# EAGLE board starduino (EAGLE 7.6.0)
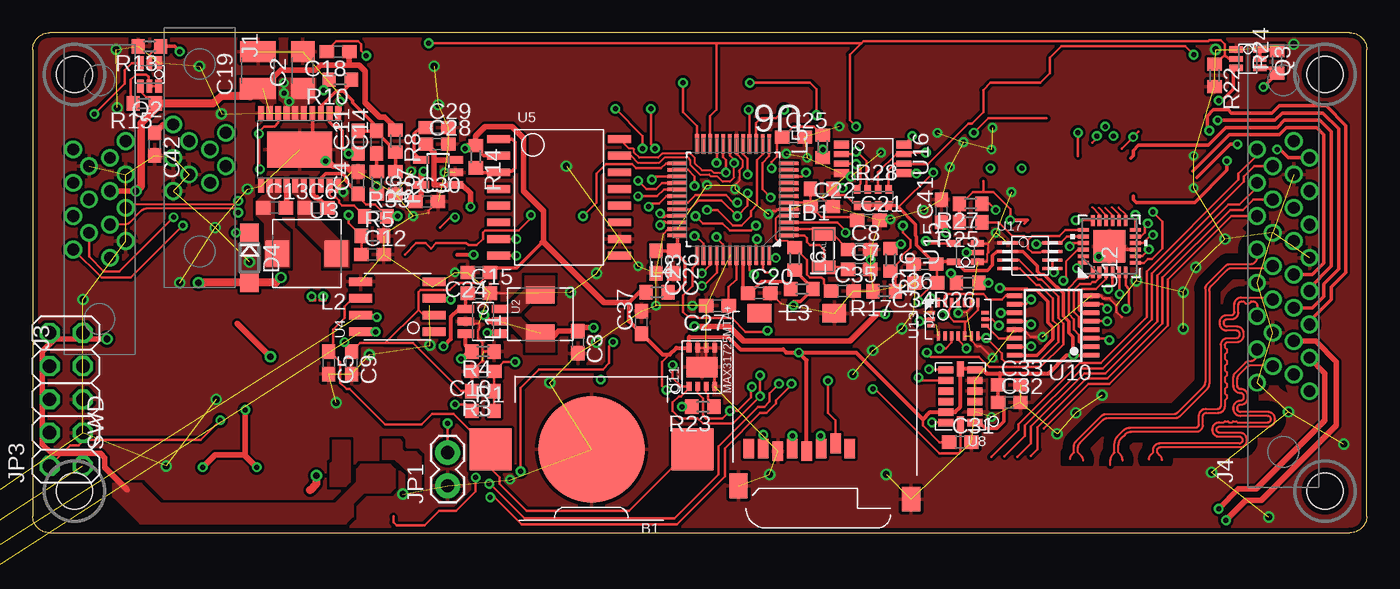
[diagram p2: board, top side]
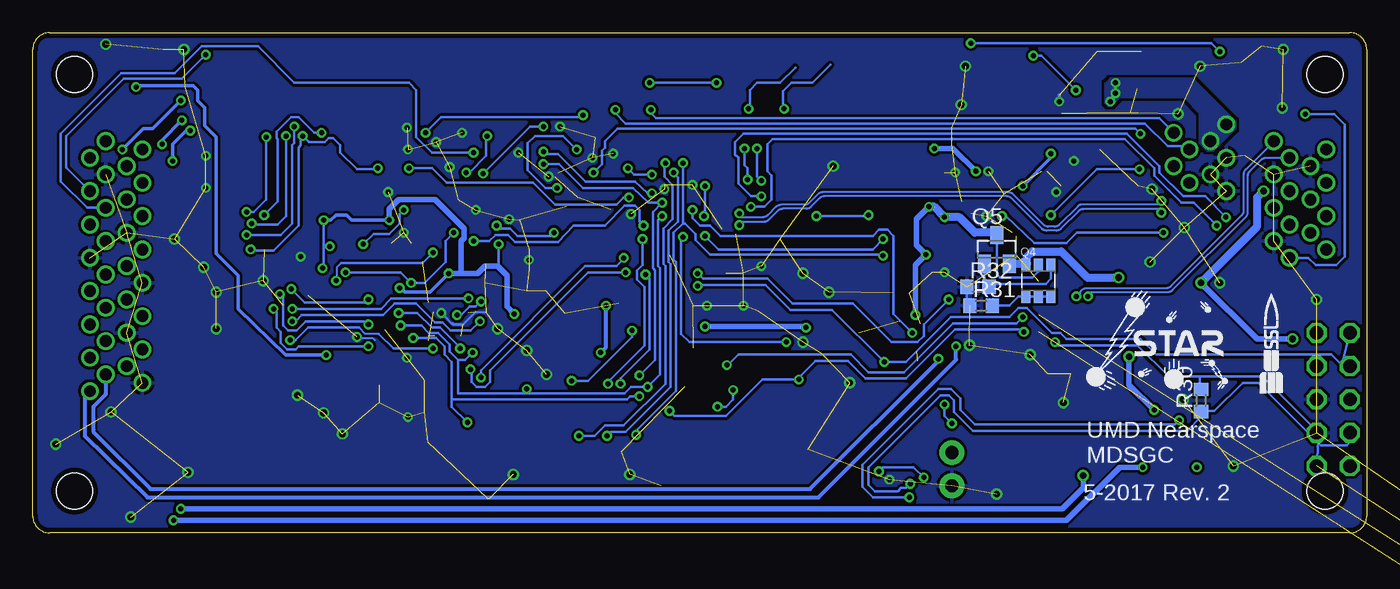
[diagram p3: board, bottom side, seen from below]

Size 101.6 x 38.1 mm. Coordinates in mm from the lower left corner, seen from the top.
Outline: 1.27,0 100.33,0 arc90 101.6,1.27 101.6,36.83 arc90 100.33,38.1 1.27,38.1 arc90 0,36.83 0,1.27 arc90 1.27,0
Copper layers (1*16): Top 0.0356mm / dielectric 1.5011mm / Bottom 0.0356mm
Design rules "LaenPCBOrder *": minimum track width 6mil, minimum drill 13mil, track to track 6mil, track to pad 6mil, pad to pad 6mil, via to via 6mil, smd to smd 6mil, copper to edge 15mil, drill to drill 6mil, minimum pad ring 7mil, minimum via ring 7mil, stop-mask expansion 4mil, vias tented up to drill 20mil, thermal gap 10mil
Net classes: 0 default: width 0.152 mm, drill 0.381 mm, clearance 0.152 mm; 1 PWR_SIG: width 0.203 mm, drill 0.381 mm, clearance 0.152 mm; 2 CTRL_SIG: width 0.203 mm, drill 0.381 mm, clearance 0.152 mm; 3 DIFF_PAIR: width 0.152 mm, drill 0.33 mm, clearance 0.152 mm
Holes 2.75 mm at 3.17,34.92 3.17,3.17 98.42,3.17 98.42,34.92

## Footprints (pad centres in the part's own frame; a part is rotated, then mirrored left to right if it is on the bottom)
CR1025 = smd 3.2 x 3.2: 1 -7.695,0; 2 7.695,0 | smd 8.13 x 8.13: 3 0,0
C1206 = smd 1.6 x 1.8: 1 -1.4,0; 2 1.4,0
C0603 = smd 1.1 x 1: 1 -0.85,0; 2 0.85,0
C1210 = smd 1.6 x 2.7: 1 -1.4,0; 2 1.4,0
SOD123 = smd 1.4 x 1.4: A 1.9,0; C -1.9,0
0603 = smd 1 x 1.1: 1 -0.85,0; 2 0.85,0
ZKN-9-J30 = drill 0.9: 1 -2.54,-2; 2 -1.27,-0.8; 3 0,-2; 4 1.27,-0.8; 5 2.54,-2; 6 -1.905,2; 7 -0.635,0.8; 8 0.635,2; 9 1.905,0.8
MICROSD_PUSH_PUSH_AMPHENOL = smd 0.8 x 1.5: 1 -1.915,2.95; 2 -0.815,2.55; 3 0.285,2.95; 4 1.385,3.15; 5 2.485,2.95; 6 3.585,3.15; 7 4.685,2.95; 8 5.785,2.95 | smd 1.8 x 1.4: CD1 4.975,-7.35; G3 -0.725,-7.35 | smd 1.4 x 1.9: G1 -6.575,6.8; G2 6.575,5.8
ZKN-15-J30 = drill 0.9: 1 -4.445,-0.8; 2 -3.175,-2; 3 -1.905,-0.8; 4 -0.635,-2; 5 0.635,-0.8; 6 1.905,-2; 7 3.175,-0.8; 8 4.445,-2; 9 -3.81,2; 10 -2.54,0.8; 11 -1.27,2; 12 0,0.8; 13 1.27,2; 14 2.54,0.8; 15 3.81,2
ZKN-31-J30 = drill 0.9: 1 -9.525,-2; 2 -8.255,-0.8; 3 -6.985,-2; 4 -5.715,-0.8; 5 -4.445,-2; 6 -3.175,-0.8; 7 -1.905,-2; 8 -0.635,-0.8; 9 0.635,-2; 10 1.905,-0.8; 11 3.175,-2; 12 4.445,-0.8; 13 5.715,-2; 14 6.985,-0.8; 15 8.255,-2; 16 9.525,-0.8; 17 -8.89,2; 18 -7.62,0.8; 19 -6.35,2; 20 -5.08,0.8; 21 -3.81,2; 22 -2.54,0.8; 23 -1.27,2; 24 0,0.8; 25 1.27,2; 26 2.54,0.8; 27 3.81,2; 28 5.08,0.8; 29 6.35,2; 30 7.62,0.8; 31 8.89,2
1X02 = drill 1.016 pad 1.88: 1 0,0; 2 2.54,0
2X05 = drill 1.016 octagon: 1 -5.08,-1.27; 2 -5.08,1.27; 3 -2.54,-1.27; 4 -2.54,1.27; 5 0,-1.27; 6 0,1.27; 7 2.54,-1.27; 8 2.54,1.27; 9 5.08,-1.27; 10 5.08,1.27
VLF504012MT(TDK) = smd 1.3 x 2.2: P$1 -1.45,0; P$2 1.45,0
SRP5030 = smd 1.8 x 2: P$1 -2.25,0; P$2 2.25,0
SC70 = smd 0.5 x 1: 1 -0.7,-0.9; 3 0.7,-0.9; 4 0.7,0.9; 6 -0.7,0.9 | smd 0.4 x 1: 2 0,-0.9; 5 0,0.9
SOT-26 = smd 0.7 x 1: 1 -0.95,-1.2; 2 0,-1.2; 3 0.95,-1.2; 4 0.95,1.2; 5 0,1.2; 6 -0.95,1.2
SOT23 = smd 1 x 1.4: 1 -0.95,-1.1; 2 0.95,-1.1; 3 0,1.1
R0603 = smd 1 x 1.1: 1 -0.85,0; 2 0.85,0
0603-ARV = smd 0.5 x 0.65: 1 -1.2,-0.625; 2 -0.4,-0.625; 3 0.4,-0.625; 4 1.2,-0.625; 5 1.2,0.625; 6 0.4,0.625; 7 -0.4,0.625; 8 -1.2,0.625
HSC-SMT-8 = smd 1.143 x 2.032: 1 -3.81,-4.699; 2 -1.27,-4.699; 3 1.27,-4.699; 4 3.81,-4.699; 5 3.81,4.699; 6 1.27,4.699; 7 -1.27,4.699; 8 -3.81,4.699
SOT23-6 = smd 0.62 x 1.23: 1 -0.95,-1.31; 2 0,-1.31; 3 0.95,-1.31; 4 0.95,1.31; 5 0,1.31; 6 -0.95,1.31
TSSOP20 = smd 0.45 x 1.05: 1 -2.925,-2.775; 2 -2.275,-2.775; 3 -1.625,-2.775; 4 -0.975,-2.775; 5 -0.325,-2.775; 6 0.325,-2.775; 7 0.975,-2.775; 8 1.625,-2.775; 9 2.275,-2.775; 10 2.925,-2.775; 11 2.925,2.775; 12 2.275,2.775; 13 1.625,2.775; 14 0.975,2.775; 15 0.325,2.775; 16 -0.325,2.775; 17 -0.975,2.775; 18 -1.625,2.775; 19 -2.275,2.775; 20 -2.925,2.775 | smd 4.95 x 2.74: PAD 0,0
SOIC-8 = smd 0.65 x 1.75: 1 -1.905,-2.8; 2 -0.635,-2.8; 3 0.635,-2.8; 4 1.905,-2.8; 5 1.905,2.8; 6 0.635,2.8; 7 -0.635,2.8; 8 -1.905,2.8
SOP2-16 = smd 0.6 x 1.75: 1 -4.445,-4.6; 2 -3.175,-4.6; 3 -1.905,-4.6; 4 -0.635,-4.6; 5 0.635,-4.6; 6 1.905,-4.6; 7 3.175,-4.6; 8 4.445,-4.6; 9 4.445,4.6; 10 3.175,4.6; 11 1.905,4.6; 12 0.635,4.6; 13 -0.635,4.6; 14 -1.905,4.6; 15 -3.175,4.6; 16 -4.445,4.6
48-TQFP = smd 1.473 x 0.279: 1 -4.242,2.743; 2 -4.242,2.261; 3 -4.242,1.753; 4 -4.242,1.245; 5 -4.242,0.762; 6 -4.242,0.254; 7 -4.242,-0.254; 8 -4.242,-0.762; 9 -4.242,-1.245; 10 -4.242,-1.753; 11 -4.242,-2.261; 12 -4.242,-2.743; 25 4.242,-2.743; 26 4.242,-2.261; 27 4.242,-1.753; 28 4.242,-1.245; 29 4.242,-0.762; 30 4.242,-0.254; 31 4.242,0.254; 32 4.242,0.762; 33 4.242,1.245; 34 4.242,1.753; 35 4.242,2.261; 36 4.242,2.743 | smd 0.279 x 1.473: 13 -2.743,-4.242; 14 -2.261,-4.242; 15 -1.753,-4.242; 16 -1.245,-4.242; 17 -0.762,-4.242; 18 -0.254,-4.242; 19 0.254,-4.242; 20 0.762,-4.242; 21 1.245,-4.242; 22 1.753,-4.242; 23 2.261,-4.242; 24 2.743,-4.242; 37 2.743,4.242; 38 2.261,4.242; 39 1.753,4.242; 40 1.245,4.242; 41 0.762,4.242; 42 0.254,4.242; 43 -0.254,4.242; 44 -0.762,4.242; 45 -1.245,4.242; 46 -1.753,4.242; 47 -2.261,4.242; 48 -2.743,4.242
SOT23-5L = smd 0.55 x 1.2: 1 -0.95,-1.3; 2 0,-1.3; 3 0.95,-1.3; 4 0.95,1.3; 5 -0.95,1.3
LGA-14 = smd 1.145 x 0.55: 1 -1.097,2; 2 -1.097,1.2; 3 -1.097,0.4; 4 -1.097,-0.4; 5 -1.097,-1.2; 6 -1.097,-2; 8 1.097,-2; 9 1.097,-1.2; 10 1.097,-0.4; 11 1.097,0.4; 12 1.097,1.2; 13 1.097,2 | smd 0.55 x 1.145: 7 0,-2.098; 14 0,2.098
TSSOP16 = smd 0.35 x 1.2: 1 -2.275,-2.925; 2 -1.625,-2.925; 3 -0.975,-2.925; 4 -0.325,-2.925; 5 0.325,-2.925; 6 0.975,-2.925; 7 1.625,-2.925; 8 2.275,-2.925; 9 2.275,2.925; 10 1.625,2.925; 11 0.975,2.925; 12 0.325,2.925; 13 -0.325,2.925; 14 -0.975,2.925; 15 -1.625,2.925; 16 -2.275,2.925
DFN-8 = smd 0.7 x 0.35: 1 -1.475,0.975; 2 -1.475,0.325; 3 -1.475,-0.325; 4 -1.475,-0.975; 5 1.475,-0.975; 6 1.475,-0.325; 7 1.475,0.325; 8 1.475,0.975 | smd 1.58 x 2.35: 9 0,0
RTW24_2P45X2P45 = smd 0.85 x 0.28: 1 -1.975,1.25; 2 -1.975,0.75; 3 -1.975,0.25; 4 -1.975,-0.25; 5 -1.975,-0.75; 6 -1.975,-1.25; 13 1.975,-1.25; 14 1.975,-0.75; 15 1.975,-0.25; 16 1.975,0.25; 17 1.975,0.75; 18 1.975,1.25 | smd 0.28 x 0.85: 7 -1.25,-1.975; 8 -0.75,-1.975; 9 -0.25,-1.975; 10 0.25,-1.975; 11 0.75,-1.975; 12 1.25,-1.975; 19 1.25,1.975; 20 0.75,1.975; 21 0.25,1.975; 22 -0.25,1.975; 23 -0.75,1.975; 24 -1.25,1.975 | smd 2.45 x 2.45: 25 0,0
LGA-20 = smd 0.675 x 0.25: 1 1.262,1.5; 2 1.262,1; 3 1.262,0.5; 4 1.262,0; 5 1.262,-0.5; 6 1.262,-1; 7 1.262,-1.5; 11 -1.262,-1.5; 12 -1.262,-1; 13 -1.262,-0.5; 14 -1.262,0; 15 -1.262,0.5; 16 -1.262,1; 17 -1.262,1.5 | smd 0.25 x 0.55: 8 0.5,-2.05; 9 0,-2.05; 10 -0.5,-2.05; 18 -0.5,2.05; 19 0,2.05; 20 0.5,2.05
SC-70-5 = smd 0.5 x 1: 1 -0.7,-0.9; 3 0.7,-0.9; 4 0.7,0.9; 5 -0.7,0.9 | smd 0.4 x 1: 2 0,-0.9
TSSOP8 = smd 0.6 x 1.15: P$1 -1.087,-2.375; P$4 1.087,-2.375; P$5 1.087,2.375; P$8 -1.087,2.375 | smd 0.45 x 1.15: P$2 -0.362,-2.375; P$3 0.362,-2.375; P$6 0.362,2.375; P$7 -0.362,2.375
SSOP8 = smd 0.25 x 1.55: 1 -0.975,-1.7; 2 -0.325,-1.7; 3 0.325,-1.7; 4 0.975,-1.7; 5 0.975,1.7; 6 0.325,1.7; 7 -0.325,1.7; 8 -0.975,1.7
2-SMD = smd 1 x 1.8: P1 -1.275,0; P2 1.275,0

## Placement (x,y rotation side)
B1  CR1025  [CR1025]  42.55,6.35 180 top
C2  22uF  [C1206]  20.56,35.24 90 top
C3  1uF  [C0603]  41.51,14.53 270 top
C4  1uF  [C0603]  24.77,26.67 90 top
C5  1nF  [C0603]  22.54,12.94 270 top
C6  100nF  [C0603]  21.59,24.77 0 top
C7  6.8pF  [C0603]  62.94,20.08 0 top
C8  6.8pF  [C0603]  62.94,21.59 0 top
C9  100nF  [C0603]  24.29,12.94 270 top
C10  100nF  [C0603]  34.29,12.3 180 top
C11  10pF  [C0603]  24.77,29.77 90 top
C12  47pF  [C0603]  25.88,21.19 0 top
C13  100nF  [C0603]  18.41,24.77 0 top
C14  680pF  [C0603]  26.19,29.77 90 top
C15  1uF  [C0603]  33.97,18.26 0 top
C18  47pF  [C0603]  23.26,36.67 180 top
C19  47uF  [C1210]  17.14,35.24 90 top
C20  10uF  [C0603]  55.32,18.26 0 top
C21  10uF  [C0603]  63.66,23.81 0 top
C22  100nF  [C0603]  60.09,24.84 0 top
C23  100nF  [C0603]  47.47,20.64 270 top
C24  100nF  [C0603]  33.97,19.84 180 top
C25  100nF  [C0603]  57.94,30.16 0 top
C26  100nF  [C0603]  48.82,20.64 270 top
C27  1uF  [C0603]  52.15,17.3 180 top
C28  1uF  [C0603]  30.8,29.61 0 top
C29  100nF  [C0603]  30.8,30.88 0 top
C30  2.2uF  [C0603]  30,25.24 0 top
C31  10uF  [C0603]  70.64,6.91 0 top
C32  100nF  [C0603]  74.37,9.92 0 top
C33  100nF  [C0603]  74.37,11.27 0 top
C34  100nF  [C0603]  68.02,19.05 180 top
C35  100nF  [C0603]  61.67,18.41 0 top
C36  100nF  [C0603]  67.94,20.48 180 top
C37  100nF  [C0603]  46.35,16.03 90 top
C41  100pF  [C0603]  69.22,24.53 90 top
C42  1uF  [C0603]  9.29,29.61 270 top
D4  B0520LW-7-F  [SOD123]  16.51,20.95 270 top
FB1  BLM18KG221BH1D  [0603]  60.09,26.19 180 top
J1  J30J-9J30  [ZKN-9-J30]  12.7,28.57 270 top
J2  MICRO_SD  [MICROSD_PUSH_PUSH_AMPHENOL]  60.33,9.37 180 top
J3  J30J-15J30  [ZKN-15-J30]  5.08,25.4 90 top
J4  J30J-31J30  [ZKN-31-J30]  95.25,20.32 90 top
JP1  [1X02]  31.59,3.57 90 top
JP3  [2X05]  2.54,10.16 90 top
L1  22uH  [VLF504012MT(TDK)]  38.66,16.67 90 top
L2  4.7uH  [SRP5030]  20.88,21.27 180 top
L3  10uH  [0603]  58.58,18.57 180 top
L4  10uH  [0603]  47.55,18.34 0 top
L5  10uH  [0603]  60.17,29.45 90 top
L6  10uH  [0603]  58.02,20.88 270 top
Q2  BSS8402DW  [SC70]  8.89,34.92 180 top
Q3  BSS8402DW  [SC70]  92.55,36.12 270 top
Q4  DMMT5401  [SOT-26]  25,19.21 0 bottom
Q5  DMG2305UX  [SOT23]  28.18,21.59 0 bottom
R1  330  [R0603]  34.29,9.29 0 top
R3  10k  [R0603]  34.29,10.79 180 top
R4  6.2  [R0603]  34.29,13.81 180 top
R5  33k  [R0603]  25.88,22.62 0 top
R6  33k  [R0603]  26.19,26.67 270 top
R8  845k  [R0603]  27.62,29.84 270 top
R9  158k  [R0603]  27.62,26.67 270 top
R10  10k  [R0603]  23.42,34.53 180 top
R13  100k  [R0603]  8.89,37.07 180 top
R14  4.7k  [R0603]  33.73,28.65 270 top
R15  191k  [R0603]  8.49,32.7 180 top
R16  3.6k  [R0603]  65.33,20.8 270 top
R17  6.8k  [R0603]  64.85,18.41 180 top
R22  100k  [R0603]  90.01,34.85 270 top
R23  4.7k  [R0603]  51.04,9.6 180 top
R24  191k  [R0603]  94.77,35.88 90 top
R25  4.7k  [R0603]  71.44,23.65 180 top
R26  220k  [R0603]  71.2,19.05 180 top
R27  4.7k  [R0603]  71.44,25.08 180 top
R28  4.7k  [0603-ARV]  63.98,25.56 180 top
R30  10k  [R0603]  12.62,10.08 90 bottom
R31  10k  [R0603]  29.37,17.3 0 bottom
R32  47k  [R0603]  29.61,18.73 0 bottom
R33  1M  [R0603]  26.11,24.13 0 top
U1  SSCMNNN015PA2A3  [HSC-SMT-8]  -17.78,-5.08 0 top  (outside the outline)
U2  LT3465/A  [SOT23-6]  34.29,16.11 270 top
U3  LTC3112FE  [TSSOP20]  20.32,29.21 180 top
U4  DS3231MZ+  [SOIC-8]  27.78,17.22 90 top
U5  MT25QL01GBBB8ESF-0AAT  [SOP2-16]  40.08,25.56 270 top
U6  ATSAMD21G18  [48-TQFP]  53.34,25.4 180 top
U7  MIC5319  [SOT23-5L]  30.88,27.46 90 top
U8  ADXL375BCCZ  [LGA-14]  70.64,10.4 180 top
U10  MC14504BDTG  [TSSOP16]  77.71,15.8 90 top
U11  MAX31725MTA+  [DFN-8]  50.96,12.62 90 top
U12  TCA9535_RTW_24  [RTW24_2P45X2P45]  81.99,21.83 90 top
U13  BMX055  [LGA-20]  70.48,16.27 90 top
U15  MC74VHC1GT125  [SC-70-5]  71.04,21.35 90 top
U16  PCA9515A  [TSSOP8]  63.98,28.5 270 top
U17  PCA9306DCT  [SSOP8]  75.96,21.11 270 top
U$1  STAR  [STAR_.3IN]  21.35,10.87 0 bottom
U$2  SSL.3IN_SILK  [SSL_SILK_.3IN]  8.49,10.64 0 bottom
XTAL1  ABS07AIG-32.768KHZ-1-T  [2-SMD]  60.25,21.51 270 top

## Tracks (layer width: path | path; a pad name or v marks a point on that pad's centre or on a via)
5V_S  (via drill 0.38)  (1 unrouted)
  Top 0.203: U7.1 32.02,26.51 | U7.3 32.02,28.42 | 72.39,25.96 71.6,25.96 70.72,25.08 R27.2 | 72.39,25.96 73.18,25.96 74.45,24.69 v74.45,23.81 | 72.39,26.82 72.39,25.96 | v66.12,21.99 65.78,21.65 R16.1 | 79.46,20.25 v79.53,20.16 79.6,20.16 U12.24 | 75.75,23.81 75.51,23.57 | U12.18 80.73,23.81 v79.45,23.81 | v78.98,21.83 79.23,22.08 U12.21 | R26.2 69.93,19.47 | 31.02,23.24 31.83,24.05 v32.15,24.05 | C3.1 41.77,15.64
  Top 0.254: U12.23 U12.24 | 70.59,23.55 R25.2 R27.2 | 79.46,23.8 v79.45,23.81 | v74.45,23.81 75.75,23.81 | v69.93,19.76 69.93,19.47 | v73.66,18.65 73.9,18.65 73.98,18.57 75.72,18.57 75.8,18.49 76.44,18.49 77.31,17.62 77.31,16.03 77.71,15.64 77.71,14.76 76.47,13.52 U10.16
  Top 0.305: 32.33,21.19 v33.58,21.19
  Top 0.406: 30.56,28.42 30.56,26.51 32.02,26.51 | 32.02,28.42 30.56,28.42 | C3.1 40.06,15.38 39.61,14.92 39.16,14.92 L1.P$1 | v34.37,16.59 34.85,16.11 U2.5 | v64.93,16.67 64.29,16.67 62.23,14.61 54.13,14.61 53.02,15.72 v50.4,15.72 | v42.7,15.64 41.77,15.64 | v33.34,24.84 33.34,25.88 32.7,26.51 32.02,26.51 U7.1 | C28.1 30.56,29 30.56,28.42
  Bottom 0.203: 66.2,20.32 66.12,20.4 v66.12,21.99 | v79.53,20.16 79.45,20.24 79.45,21.75 | 79.45,21.75 v79.45,23.81 | v78.98,21.83 79.38,21.83 79.45,21.75 | 28.43,22.94 Q5.3 28.18,19.68 27.94,19.45 25.48,19.45 25,19.92 Q4.5
  Bottom 0.254: v74.45,23.81 77.31,23.81 77.71,24.21 78.5,24.21 78.9,23.81 v79.45,23.81 | v73.66,18.65 73.58,18.65 73.26,18.34 71.36,18.34 v69.93,19.76
  Bottom 0.406: v34.37,16.59 34.37,20.4 v33.58,21.19 34.29,21.91 34.29,23.89 v33.34,24.84 | v74.45,23.81 74.45,24.69 73.74,25.4 70.96,25.4 68.74,23.18 68.74,22.46 68.98,22.23 68.98,19.92 69.14,19.76 | v64.93,16.67 65.48,17.22 65.48,19.61 66.2,20.32 67.15,20.32 67.71,19.76 69.14,19.76 | v50.4,15.72 42.78,15.72 v42.7,15.64 | 69.14,19.76 v69.93,19.76
  Bottom 0.61: 28.43,22.94 28.51,22.86 29.84,22.86 31.04,24.05 v32.15,24.05 32.94,24.84 v33.34,24.84
  pour Top (rank 2, no thermals): 35,16.35 37.15,16.35 38.42,15.08 39.69,15.08 39.69,13.81 37.62,13.81 37.62,14.53 36.35,15.88 35,15.88
+3V3  (via drill 0.38)  (2 unrouted)
  Top 0.203: U10.1 79.98,13.52 | U13.3 69.98,17.2 69.77,16.99 69.77,16.59 v69.29,16.59 69.69,16.59 70.17,16.11 70.98,16.11 | 70.98,16.11 71.12,16.11 71.98,16.98 U13.7 | U13.13 70.98,16.11 | v67.47,17.62 67.47,17.86 68.66,19.05 C34.1 68.87,20.4 C36.1 68.97,20.65 | C31.1 69.06,6.91 67.79,8.18 67.79,8.65 | R23.2 v49.45,9.6 | C24.1 34.03,19.05 32.31,19.05 31.75,18.49 29.53,18.49 29.37,18.34 29.37,16.99 | 29.37,16.99 29.77,16.59 U4.2 | 29.37,16.99 26.83,14.45 | 26.83,14.45 24.92,14.45 24.29,13.81 C9.1 23.73,14.34 v23.73,14.53 | v57.94,17.3 57.94,17.62 | 26.83,14.45 28.97,14.45 32.62,10.79 R3.2 | v48.26,10.87 47.94,11.19 47.94,13.02 48.5,13.57 | U16.P$8 66.99,30.22 v66.99,30.24 | v68.58,27.46 65.92,24.8 | R28.5 62.7,24.93 61.91,25.72 61.41,25.72 FB1.1 61.59,26.19 v61.67,26.27 | v60.17,29.21 L5.1
  Top 0.254: C32.1 C33.1 73.66,11.49 73.66,12.14 | U8.6 71.64,12.5 | 73.82,9.71 C32.1 | v93.74,33.97 93.98,34.23 R24.1 94.39,35.42 Q3.4 | U10.1 79.24,13.52 v79.26,13.53 79.22,13.65 79.22,14.92 78.9,15.24 78.9,16.11 78.5,16.51 78.5,18.26 78.03,18.73 77.95,18.73 76.99,19.68 76.76,19.68 76.52,19.92 76.52,20.32 75.4,21.44 U17.2 73.43,21.44 73.1,21.11 73.1,20.4 72.71,20 70.96,20 70.31,20.65 U15.5 68.97,20.65 | U5.2 34.35,28.73 R14.1 | 57.94,17.62 58.48,17.62 L3.1 59.43,18.62 L6.2 58.02,19.98 | C24.1 35.22,20.16 36.83,20.16 38.77,22.11 | U8.1 72.09,8.4 72.55,7.94 73.42,7.94 73.98,8.49 73.98,9.47 C32.1 | R28.5 R28.6 R28.7 R28.8 65.79,24.93 65.92,24.8 67.23,23.5 67.23,22.7 67.31,22.54 67.31,21.91 68.74,20.48 C36.1 | 29.58,25.64 29.18,25.24 C30.1 | U11.8 49.94,14.05 | 46.2,18.34 L4.1
  Top 0.305: U8.6 72.4,12.4 72.65,12.14 73.66,12.14 77.39,12.14 78.78,13.53 v79.26,13.53 | 71.64,12.5 U8.7 70.64,9.6 70.24,9.2 U8.12 68.33,9.2 67.79,8.65 62.71,13.73 v58.34,13.73 | 49.98,14.92 U11.8 49.02,14.1 48.5,13.57 47.97,13.57 C37.1 45.4,16.14 45.4,17.54 46.2,18.34 | 49.98,14.92 | 49.98,14.92 52.94,14.92 53.9,13.97 57.15,13.97 57.39,13.73 v58.34,13.73 | J2.4 58.94,13.13 v58.34,13.73
  Top 0.406: 29.58,25.64 U7.5 29.58,27.35 v29.77,27.54 | v32.94,29.29 33.12,29.5 R14.1 33.73,30.24 34.45,30.96 36.51,30.96 37.39,30.08 37.39,26.04 38.89,24.53 38.89,22.15 | 38.77,22.11 38.89,22.15 | 38.89,22.15 43.5,17.54 45.4,17.54
  Bottom 0.203: v69.29,16.59 68.98,16.59 68.34,17.22 67.87,17.22 v67.47,17.62 | v49.45,9.6 48.82,9.6 48.26,10.16 v48.26,10.87 | v23.73,14.53 23.5,14.29 17.46,14.29 15.08,11.91 12.7,11.91 | 12.7,11.91 7.94,11.91 3.65,7.62 JP3.1 | v66.99,30.24 67.07,30.16 67.07,28.73 68.34,27.46 v68.58,27.46 | R30.2 12.7,11.01 12.7,11.91 | v61.67,26.27 62.55,26.27 63.9,27.62 63.9,29.69 63.34,30.24 61.2,30.24 v60.17,29.21
  Bottom 0.254: v93.74,33.97 93.66,34.05 89.38,34.05 89.06,33.73 89.06,32.94 88.5,32.38 88.5,31.04 87.63,30.16 87.63,21.27 85.96,19.61 85.96,17.07 82.35,13.53 v79.26,13.53
  Bottom 0.305: v58.34,13.73 57.94,14.13 v57.94,17.3
  Bottom 0.406: v29.77,27.54 31.51,29.29 v32.94,29.29
+5V  (via drill 0.51)  (1 unrouted)
  Top 0.203: R15.1 8.87,33.18 8.65,33.18 8.19,33.64 Q2.4
  Top 0.406: 24.11,35.64 21.91,35.64 21.51,35.24 18.89,35.24 17.49,33.84 C19.1 16.56,33.26 | 24.11,35.64 C18.1 | 24.11,35.64 24.84,35.64 25.32,35.16 25.32,32.78 26.43,31.67 26.81,31.67 27.62,30.85 R8.1 | v7.86,26.04 J3.5 | v5.64,14.76 1.67,14.76 0.71,13.81 0.71,6.75 1.43,6.03 5.16,6.03 5.48,5.71 5.48,5 7.19,3.29 | 13.02,19.05
  Top 0.559: 8.26,26.43 8.26,31.22 9.34,32.31
  Top 0.61: 16.56,33.26 14.37,33.26 13.73,32.7 R15.1 9.34,32.31 | 13.02,19.05 D4.A 18.5,19.05 v18.89,19.45 | v7.86,26.04 8.26,26.43 | 13.02,19.05 v12.62,19.05
  Bottom 0.203: Q4.6 26.03,20.49
  Bottom 0.406: Q4.6 25.88,20.49 | v12.62,19.05 8.33,14.76 v5.64,14.76
  Bottom 0.61: v12.62,19.05 8.33,23.34 8.33,25.56 v7.86,26.04 | 25.88,20.49 25.88,21.03 25.48,21.43 23.26,21.43 21.27,19.45 v18.89,19.45 | 26.03,20.49 Q5.2
  pour Top (rank 2, no thermals): 17.86,31.43 17.86,32.46 17.22,33.1 15.8,33.1 15.8,34.61 18.49,34.61 18.49,32.7 18.26,32.46 18.26,31.43
  pour Top (rank 2, no thermals): 27.54,4.84 27.23,5.16 25,5.16 24.69,4.84 24.69,3.89 23.02,2.22 22.7,2.22 22.7,0.71 23.81,0.71 24.37,1.27 24.37,2.22 25.24,3.1 27.23,3.1 27.54,3.41
  pour Top (no thermals): 6.11,3.73 8.26,3.73 9.76,2.22 22.7,2.22 22.7,0.71 8.18,0.71 6.19,2.7 6.11,2.78
BIAS_GND  (via drill 0.38, 0.51)
  Top 0.406: v90.33,1.83 91.84,3.33 93.19,3.33 98.42,8.57 98.42,12.14 97.25,13.32 J4.3
  Top 0.61: v21.59,4.37 21.59,3.73 21.11,3.25
  Bottom 0.406: v21.59,4.37 21.59,3.41 23.18,1.83 v90.33,1.83
BIAS_V  (via drill 0.38, 0.51)
  Top 0.406: v90.88,0.95 92.39,2.46 93.58,2.46 99.3,8.18 99.3,13.02 97.71,14.61 J4.4 | v17.07,5 16.19,5.87 16.19,5.95 | 16.19,5.95 v16.19,9.37 | v18.1,13.41 15.56,15.95 | v12.94,5 13.89,5.95 16.19,5.95
  Bottom 0.406: v90.88,0.95 22.86,0.95 18.81,5 v17.07,5 | v16.19,9.37 18.1,11.27 v18.1,13.41
C_3V3
  Top 0.203: 73.01,5.78 75.09,7.86 75.09,8.26 79.77,12.94 81.36,12.94 84.85,16.43 84.85,19.92 91.84,26.91 91.84,27.38 93.25,28.8 J4.31
C_SCL0
  Top 0.203: 75.01,5.79 76.04,6.83 76.04,8.1 80.09,12.14 81.68,12.14 85.65,16.11 85.65,19.61 91.04,25 91.92,25 93.25,26.34 J4.29
C_SDA0
  Top 0.203: 74.01,5.83 75.56,7.38 75.56,8.18 79.93,12.54 81.52,12.54 85.25,16.27 85.25,19.76 92.23,26.75 92.23,27.15 93.03,27.94 J4.30
CAM1_C_N
  Top 0.152: 80.01,5.5 arc45 79.86,5.86 79.61,6.11 79.61,6.47 arc-45 79.76,6.83 81.51,8.59 arc-45 81.87,8.74 87.01,8.74 arc45 87.37,8.89 89.46,10.98 arc45 89.61,11.34 89.61,18.46 arc-45 89.76,18.82 90.96,20.02 arc-45 91.32,20.17 94.09,20.17 arc45 J4.24
CAM1_C_P
  Top 0.152: 79.01,5.61 arc-45 79.16,5.97 79.3,6.11 79.3,6.6 arc-45 79.45,6.96 81.39,8.89 arc-45 81.75,9.04 86.88,9.04 arc45 87.24,9.19 89.15,11.11 arc45 89.3,11.46 89.3,18.59 arc-45 89.45,18.94 90.83,20.32 arc-45 91.19,20.47 92.74,20.47 arc90 93.25,20.98 J4.25
CAM1_D0_N
  Top 0.152: 86.01,5.53 arc45 85.86,5.89 85.64,6.11 85.64,6.27 arc-90 85.88,6.51 91.96,6.51 arc90 92.47,7.02 92.47,7.11 arc90 91.96,7.61 90.41,7.61 arc-90 90.16,7.86 arc-90 90.41,8.1 94.1,8.1 arc90 94.61,8.61 94.61,8.69 arc90 94.1,9.2 92,9.2 arc-90 91.75,9.45 91.75,9.53 arc-90 92,9.77 92.04,9.77 arc90 92.55,10.28 92.55,10.44 arc90 92.04,10.95 92,10.95 arc-90 91.75,11.19 91.75,11.71 arc-45 91.9,12.07 92.47,12.64 arc-45 92.83,12.79 94.24,12.79 arc-45 J4.18
CAM1_D0_P
  Top 0.152: 85.01,5.58 arc-45 85.16,5.94 85.33,6.11 85.33,6.31 arc-90 85.84,6.82 91.92,6.82 arc90 92.16,7.06 arc90 91.92,7.31 90.37,7.31 arc-90 89.86,7.82 89.86,7.9 arc-90 90.37,8.41 90.73,8.41 90.81,8.49 91.04,8.49 91.13,8.41 91.35,8.41 91.44,8.49 91.68,8.49 91.76,8.41 94.06,8.41 arc90 94.3,8.65 arc90 94.06,8.9 92,8.9 arc-90 91.45,9.45 91.45,9.53 arc-90 92,10.07 arc90 92.24,10.32 92.24,10.4 arc90 92,10.64 91.95,10.64 arc-90 91.45,11.23 91.45,11.84 arc-45 91.59,12.2 91.73,12.33 92.34,12.94 arc-45 92.7,13.09 92.74,13.09 arc90 93.25,13.6 J4.19
CAM1_D1_N
  Top 0.152: 83.01,5.49 arc45 82.79,6.03 82.7,6.11 82.7,6.69 arc-45 82.93,7.22 83.21,7.51 arc-45 83.68,7.71 88.62,7.71 arc90 89.13,8.21 89.13,8.89 arc-90 89.38,9.13 90.29,9.13 arc90 90.8,9.64 90.8,10.07 90.96,10.24 90.96,10.48 90.81,10.64 90.81,10.95 90.96,11.11 90.96,11.35 90.81,11.51 90.81,11.83 90.96,11.99 90.96,12.22 90.81,12.38 90.81,12.7 90.96,12.86 90.96,13.1 90.81,13.26 90.81,13.57 90.96,13.73 90.96,13.97 90.81,14.13 90.81,14.28 90.8,14.29 arc-90 91.04,14.53 91.72,14.53 arc90 92.23,15.04 92.23,15.2 arc90 91.72,15.71 90.96,15.71 arc-90 90.72,15.95 90.72,16.03 arc-90 90.96,16.28 91.32,16.28 arc90 91.83,16.79 91.83,17.38 arc-90 92.08,17.63 92.23,17.63 92.39,17.46 92.63,17.46 92.8,17.63 92.94,17.63 arc-90 93.27,17.3 93.27,16.53 arc-90 J4.21
CAM1_D1_P
  Top 0.152: 82.07,5.14 82.07,5.47 arc-45 82.3,6.01 82.4,6.11 82.4,6.81 arc-45 82.62,7.35 83.06,7.79 arc-45 83.6,8.01 88.58,8.01 arc90 88.83,8.26 88.83,8.93 arc-90 89.33,9.44 90.25,9.44 arc90 90.49,9.68 90.49,14.33 arc-90 91,14.84 91.68,14.84 arc90 91.92,15.08 91.92,15.16 arc90 91.68,15.4 90.92,15.4 arc-90 90.41,15.91 90.41,16.07 arc-90 90.92,16.58 91.28,16.58 arc90 91.53,16.83 91.53,17.42 arc-90 92.03,17.93 94.3,17.93 arc-90 J4.22
CAM_CLK
  Top 0.203: 76.01,5.84 76.52,6.35 76.52,8.02 80.25,11.75 81.84,11.75 86.04,15.95 86.04,19.45 91.2,24.61 92.15,24.61 92.95,25.4 J4.28
CAM_GPIO
  Top 0.203: J4.27 91.28,24.13 86.44,19.29 86.44,15.8 81.99,11.35 80.41,11.35 77.01,7.95
DEBUG_5V  (via drill 0.38)
  Top 0.203: v4.68,31.91 6.99,34.21 6.99,35.24 7.54,35.8 8.16,35.8 Q2.3
  Bottom 0.203: v4.68,31.91 2.46,31.91 1.67,31.11 1.67,21.03 2.3,20.4 3.89,20.4 4.45,20.95 J3.1
DEC0
  Top 0.152: U12.15 82.24,24.2 81.69,24.75
DEC1
  Top 0.152: U12.13 83.24,24.23 82.69,24.79
DIR  (via drill 0.38)
  Top 0.203: U12.12 83.98,23.41 v83.98,24.21 | 79.61,28.7 v79.61,30.48
  Bottom 0.203: v83.98,24.21 82.95,25.24 82.95,30 83.03,30.08 83.03,30.56 81.92,31.67 81.36,31.67 80.17,30.48 v79.61,30.48
EN_28V  (via drill 0.38)
  Top 0.203: U6.41 52.58,21.95 52.07,22.46 v52.07,22.54 | v44.21,14.53 43.89,14.21 43.89,12.94 43.42,12.46 38.58,12.46 37.15,11.03 v37.15,4.68 | 27.46,1.24 27.46,0.79 27.7,0.56 29.84,0.56 30.96,1.67 32.23,1.67 33.73,3.17 v33.73,4.21
  Bottom 0.203: v52.07,22.54 52.23,22.38 52.23,15.16 51.59,14.53 v44.21,14.53 | v37.15,4.68 36.83,5 34.53,5 v33.73,4.21
EXTERNAL_3V3  (via drill 0.38)
  Top 0.254: J4.15 95.65,28.57 95.01,29.21 v94.77,29.21 | v90.33,32.94 90.57,32.94 91.44,33.81 91.44,35.2 Q3.3
  Bottom 0.254: v94.77,29.21 93.19,30.8 92.47,30.8 v90.33,32.94
EXTERNAL_KILL  (via drill 0.38)
  Top 0.203: R22.1 90.81,36.41 | 90.81,36.41 90.81,37.23 90.49,37.54 89.61,37.54 89.53,37.47 63.26,37.47 63.1,37.31 | 63.1,37.31 62.23,36.43 62.23,31.43 v62.71,30.96 | 63.1,37.31 52.07,37.31 | 52.07,37.31 v30.16,37.31 | U6.22 51.59,31.74 52.07,32.23 52.07,37.31 | U16.P$5 66.38,27.38 v67.31,27.38 | Q3.2 91.1,36.12 90.81,36.41 | Q2.2 8.89,36.43 9.53,37.07 R13.1
  Top 0.254: R13.1 10.79,37.07 v11.19,36.67
  Bottom 0.203: v30.16,37.31 11.83,37.31 v11.19,36.67 | v67.31,27.38 63.74,30.96 v62.71,30.96
FB_5
  Top 0.203: U3.3 21.95,32.5
  Top 0.254: 23.65,33.66 23.1,33.66 21.95,32.5 | 23.65,33.66 24.37,32.94 24.37,32.78 26.04,31.11 | 23.65,33.66 24.11,34.11 R10.1 | 27.58,27.2 R9.1 R8.2 27.38,29.37 25.88,30.88 26.04,31.11 | 26.04,31.11 26.19,30.96 C14.2 C11.2
GND  (via drill 0.38, 0.51)  (154 unrouted)
  Top 0.152: U15.1 72.64,20.65 72.71,20.72 72.71,21.27 72.79,21.35 72.79,22.07 72.77,22.05 U15.3 | U6.35 48.38,23.14 48.02,22.78 | U6.35 49.05,23.18 | U2.2 33.14,15.95 33.97,15.95 33.97,15.48 33.89,15.4 33.89,14.84 34.13,14.61 34.29,14.61 34.23,14.55 34.23,13.1 | C15.2 36.12,18.26 | U6.18 53.59,28.88 54.05,28.42 54.05,27.86 53.82,27.62 53.82,26.83 53.5,26.51
  Top 0.203: U10.8 81.31,18.07 81.52,17.86 81.99,17.86 82.55,17.3 82.55,16.83 82.95,16.43 | U11.6 U11.5 | U11.6 U11.7 | U11.6 51.28,12.95 U11.9 51.93,12.62 U11.4 | U12.25 v81.2,21.03 | U10.13 75.49,15.48 76.04,14.92 v76.91,14.92 | 71.48,14.64 71.91,14.21 72.23,14.21 v73.1,13.34 | U13.6 71.48,17.19 71.12,16.83 v70.48,16.75 U13.4 | U6.5 56.71,24.64 56.59,24.53 56.28,24.53 v56.04,24.29 | 22.86,27.94 22.46,28.34 v22.3,28.34 | v23.65,25.96 23.25,26.36 U3.20 | 34.29,13.81 R4.1 | C10.2 34.23,13.1 34.29,13.1 | R5.2 27.02,22.92 | C30.2 30.16,24.55 30.16,24.37 | C22.2 60.8,24.84 60.09,25.56 | v62.31,27.15 61.86,27.15 U16.P$4 | C20.2 56.2,18.26 56.99,17.46
  Top 0.254: U3.1 23.42,32.16 v23.42,32.86 | U3.4 21.3,30.18 20.95,29.84 U3.PAD | U12.9 81.69,21.58 U12.25
  Top 0.406: C4.2 24.31,27.52 23.89,27.94 22.86,27.94 20.95,29.84
  Bottom 0.152: v76.91,14.92 76.83,14.84 75.72,14.84 75.56,14.68 | 68.82,15.88 67.87,16.83 67.07,16.83
  Bottom 0.203: v70.48,16.75 70.25,16.59 70.25,16.51 69.69,15.95 69.61,15.95 69.53,15.88 68.82,15.88 | R31.1 30.46,17.54 R32.1
  Bottom 0.254: v23.42,32.86 23.42,33.34
  other vias: 10.16,5.08 13.97,10.16 3.81,17.78 11.19,19.05 12.7,35.56 40.64,27.94 39.37,11.43 56.12,4.45 65.01,4.45 62.47,12.06 79.45,9.13 78.03,7.54 81.44,10.48 87.63,15.56 87.63,18.34 88.58,20.24 90.81,22.38 88.42,28.73 88.42,26.27 84.06,19.21 63.98,13.89 66.2,15.56 73.34,22.86 74.53,25.96 73.03,29.21 73.1,30.88 65.33,23.89 63.82,20.8 73.03,8.81 13.89,23.26 16.51,20.64 25.64,13.57 23.1,9.92 28.18,2.94 50.24,17.3 47.47,17.3 42.94,14.53 40.96,18.34 42.94,19.76 46.12,20.32 32.15,19.84 36.35,4.05 30.24,14.29 53.5,26.19 51.36,26.51 6.35,36.83 6.43,32.38 14.37,31.91 16.35,26.19 30.56,35.56 30.88,32.62 31.35,27.46 95.65,9.21 89.77,4.6 90.09,36.83 67.87,24.61 64.61,28.97 69.85,27.86 70.88,29.77 68.9,30.48 58.98,28.57 57.39,28.89 28.97,24.13 28.81,27.54 61.44,30.96 99.85,6.75 94.14,1.19 96.04,37.23
  pour Top (isolate 0.762): 77.71,4.13 77.71,8.26 87,17.54 87,19.29 91.76,24.05 95.96,24.05 96.76,23.26 96.68,7.86 92.95,4.13
  pour Bottom: 77.71,4.13 77.71,8.26 80.8,11.35 81.44,11.35 87,16.91 87,19.29 91.76,24.05 95.96,24.05 96.76,23.26 96.68,7.86 92.95,4.13
  pour Top: 77.15,4.29 77.15,8.1 86.68,17.62 86.68,19.37 92.47,25.16 94.54,25.16 95.25,24.45 95.25,23.89 95.09,23.73 92.55,23.73 88.27,19.53 88.34,11.75 87.47,10.87 86.36,9.92 80.88,10 78.42,7.7 78.18,7.46 78.18,4.29
  pour Top (isolate 0.203, rank 6): -2.54,40.64 -2.54,-2.54 104.14,-2.54 104.14,5 77.47,5 77.47,7.62 87.63,17.78 87.63,19.05 92.71,24.13 93.98,24.13 93.98,11.91 95.25,11.91 96.44,8.65 92.79,5.16 92.79,5.08 104.14,5.08 104.14,40.64
  pour Bottom (isolate 0.203, rank 6): -1.27,39.37 -1.27,-1.27 102.87,-1.27 102.87,39.37
I0
  Top 0.152: U12.17 81.24,24.25 80.69,24.8
I1
  Top 0.152: U12.16 81.74,24.22 81.19,24.78
I_SENSE  (via drill 0.38)
  Top 0.203: U3.8 18.7,31.24 18.41,30.96 17.62,30.96 17.22,30.56 v17.22,30.4 17.22,27.78 v17.3,27.7 | C12.1 R5.1 24.05,23.6 v24.05,24.21 | U6.10 58.59,27.15 v58.9,27.46
  Bottom 0.203: v58.9,27.46 58.26,28.1 58.26,29.13 58.02,29.37 58.02,29.84 57.07,30.8 17.62,30.8 v17.22,30.4 | v24.05,24.21 20.56,27.7 v17.3,27.7
IMUDR
  Top 0.203: U13.2 69.48,18.05 69.61,18.18 72.39,18.18 72.79,17.78 73.82,17.78 74.11,18.07 U10.9
IMUINT1  (via drill 0.38)
  Top 0.203: U10.5 v81.84,16.12 v81.84,16.11 | U13.19 67.71,16.27 v67.55,16.11
  Bottom 0.203: v81.84,16.11 81.6,16.11 81.12,16.59 74.93,16.59 74.06,17.46 72.39,17.46 70.96,16.03 70.41,16.03 69.77,15.4 68.26,15.4 v67.55,16.11
IMUINT2  (via drill 0.38)
  Top 0.203: U10.7 81.48,17.42 v81.84,17.07 | U13.1 68.66,17.86 v68.42,17.86
  Bottom 0.203: v68.42,17.86 74.3,17.86 75.09,17.07 v81.84,17.07
IMUINT3  (via drill 0.38)
  Top 0.203: U10.3 81.81,14.82 v81.99,14.68 | U13.14 70.48,14.68 v71.12,14.05
  Bottom 0.152: 75.25,15.16 76.28,15.16 76.76,15.64
  Bottom 0.203: v81.99,14.68 81.6,14.68 80.64,15.64 76.76,15.64 | v71.12,14.05 74.14,14.05 75.25,15.16
IMUINT4  (via drill 0.38)
  Top 0.203: U10.11 74,16.77 v73.74,16.75 | U13.15 69.98,14.5 69.53,14.05 v69.06,14.05
  Bottom 0.203: v73.74,16.75 72.31,16.75 71.2,15.64 70.56,15.64 69.06,14.13 v69.06,14.05
IMUINT5
  Top 0.203: U13.10 72.65,15.77 73.6,14.82 U10.14
IOEINT  (via drill 0.38)
  Top 0.203: U15.4 68.25,22.05 v68.02,22.23 | v55.09,23.42 54.69,23.02 53.1,23.02 52.55,23.57 51.04,23.57 v50.48,24.13 | U6.26 49.89,27.66 50.4,27.15 v50.4,26.43
  Bottom 0.203: v55.09,23.42 55.4,23.73 55.4,24.61 55.72,24.92 56.52,24.92 58.02,23.42 60.4,23.42 61.59,22.15 64.85,22.15 65.41,22.7 66.36,22.7 66.83,22.23 v68.02,22.23 | v50.48,24.13 50.4,24.21 v50.4,26.43
LED_CTRL  (via drill 0.38)
  Top 0.203: v34.61,15.24 35.52,15.24 U2.4 | U6.14 55.6,28.85 55.17,28.42 55.17,25 54.69,24.53 54.69,24.13 53.98,23.42 53.34,23.42 52.15,24.61 v51.36,24.61
  Bottom 0.203: v34.61,15.24 36.04,16.67 36.04,22.62 36.51,23.1 37.15,23.1 37.62,22.62 49.21,22.62 50.01,23.42 50.8,23.42 51.36,23.97 v51.36,24.61
LED_GND  (via drill 0.38)
  Top 0.305: v32.62,13.26 33.18,13.81 R4.2 32.98,14.27 U2.3
  Bottom 0.305: J4.2 96.05,10.55 97,9.6 97,7.7 92.63,3.33 42.39,3.33 32.62,13.1 v32.62,13.26
LED_V  (via drill 0.38)
  Top 0.254: U2.1 32.98,18.35 C15.1
  Top 0.305: U2.1 32.46,17.06 31.83,16.43 31.83,14.76 v31.27,14.21
  Bottom 0.305: J4.1 97.63,10.41 97.63,7.38 92.87,2.7 41.75,2.7 31.27,13.18 v31.27,14.21
M0  (via drill 0.38)
  Top 0.203: 82.19,30.12 v82.31,30.24 | v84.93,23.57 84.69,23.5 84.69,22.86 84.41,22.58 U12.11
  Bottom 0.203: v82.31,30.24 82.31,24.13 82.95,23.5 84.69,23.5 v84.93,23.57
M1  (via drill 0.38)
  Top 0.203: 81.69,30.86 v81.68,30.96 | v85.33,22.7 85.17,22.7 84.55,22.08 U12.10
  Bottom 0.203: v81.68,30.96 81.68,29.69 81.84,29.53 81.84,23.57 82.71,22.7 v85.33,22.7
MA1  (via drill 0.38)
  Top 0.254: J4.5 97.25,16.13 98.9,17.78 98.9,18.73 100.01,19.84 100.01,31.04 98.5,32.54 94.93,32.54 94.38,31.99 91.28,31.99 91.04,32.23 89.93,32.23 89.46,31.75 89.46,30.8 v89.61,30.64 | 83.82,25.65 83.82,25.4 84.06,25.16 88.5,25.16 90.96,27.62 v90.96,28.34
  Bottom 0.254: v90.96,28.34 90.96,29.61 89.93,30.64 v89.61,30.64
MA2  (via drill 0.38)
  Top 0.254: J4.6 97.47,17.14 98.35,18.02 98.35,18.97 99.46,20.08 99.46,30.8 98.27,31.99 95.17,31.99 94.61,31.43 v90.25,31.43 | 88.65,27.05 91.2,29.61 v91.76,29.61
  Bottom 0.254: v90.25,31.43 91.76,29.92 v91.76,29.61
MB1
  Top 0.254: J4.7 97.25,18.67 98.9,20.32 98.9,30.56 98.03,31.43 95.33,31.43 94.77,30.88 90.88,30.88 89.53,29.53 84.22,29.53 83.82,29.13 83.82,28.73 83.64,28.55
MB2
  Top 0.254: J4.8 97.47,19.68 98.35,20.56 98.35,30.32 97.79,30.88 95.49,30.88 94.93,30.32 91.12,30.32 88.36,27.55
MISO  (via drill 0.38)
  Top 0.203: J2.7 v55.64,7.46 | v52.07,28.18 52.09,28.2 U6.21 | U5.8 v36.83,21.11
  Bottom 0.203: v55.64,7.46 55.64,7.78 52.63,10.79 52.63,20.64 52.78,20.8 52.78,22.86 52.07,23.57 | 52.07,23.57 v52.07,28.18 | 52.07,23.57 51.91,23.57 51.12,22.78 51.12,22.3 50.01,21.19 36.99,21.19 36.91,21.11 v36.83,21.11
MOSI  (via drill 0.38)
  Top 0.152: v53.42,28.18 53.42,27.07 53.1,26.75 52.55,26.75 52.15,27.15 51.67,27.15 51.51,27.3 50.8,27.3 50.09,28.02 50.09,28.42 49.93,28.57 48.1,28.57 47.7,28.18 46.12,28.18 45.56,28.73 U5.15
  Top 0.203: J2.3 60.04,7.35 v60.01,7.38 | v53.42,28.18 53.34,28.26 53.34,28.5 53.09,28.75 U6.19
  Bottom 0.203: v60.01,7.38 58.82,7.38 58.02,8.18 56.59,8.18 53.42,11.35 53.42,20.32 53.58,20.48 53.58,23.18 52.86,23.89 52.86,26.51 53.5,27.15 53.5,28.02 v53.42,28.18
N$1
  Bottom 0.203: 24.05,20.32 Q4.4 24.05,19.36 24.45,18.97 28.44,18.97 R32.2 29.13,19.34 Q5.1 29.13,20.29
N$2
  Bottom 0.203: Q4.3 Q4.2 Q4.1 25.96,18.02 26.51,18.02 27.23,17.3 R31.2
N$3
  Top 0.203: R33.1 24.47,24.92 23.57,24.92 23.34,25.16 23.34,25.32 23.1,25.56 22.78,25.56 22.59,25.74 U3.19
N$4  (via drill 0.38)
  Top 0.203: U6.17 54.1,28.84 54.45,28.5 v54.45,27.3 | v56.28,27.78 56.28,28.26 56.67,28.65 56.67,29.9 C25.1 57.15,30.16 57.94,30.96 59.51,30.96 L5.2
  Bottom 0.203: v54.45,27.3 55.8,27.3 v56.28,27.78
N$5
  Top 0.203: U6.43 53.59,19.3 53,18.71 C27.1
N$6
  Top 0.203: R23.1 51.89,9.79 51.44,10.24 51.44,10.56 51.28,10.71 U11.3
N$7  (via drill 0.38)
  Top 0.203: JP1.2 v31.59,8.33 | v32.15,9.76 32.96,9.76 R1.1
  Bottom 0.203: v31.59,8.33 32.15,8.89 v32.15,9.76
N$8
  Top 0.203: B1.1 50.09,6.35 45.4,1.67 37.62,1.67 35.56,3.73 35.56,4.21 34.85,4.92 B1.2 | 34.92,6.35 B1.2 | 22.8,13.63 23.42,13.02 23.42,11.43 23.89,10.95 24.13,10.95 26.83,8.26 29.61,8.26 30.4,9.05 32.07,9.05 34.77,6.35 B1.2 | 22.8,13.63 C5.1 | 22.8,13.63 22.86,13.69 22.86,15.48 23.73,16.35 23.73,17.22 24.21,17.7 U4.6
N$9
  Top 0.254: U7.4 29.05,28.94 29.05,30.4 29.53,30.88 C29.1
N$10
  Top 0.203: U6.6 58.7,25.15 C22.1 | C22.1 59.37,24.77 60.09,24.05 62.57,24.05 C21.1 | FB1.2 C22.1
N$11
  Top 0.254: C14.1 R6.1
N$12  (via drill 0.38)
  Top 0.254: R6.2 v26.19,26.43 | C11.1 24.07,28.92 v24.05,28.89 23.57,29.37 23.57,30.64 23.18,31.04 22.86,31.04 22.59,31.3 U3.2
  Bottom 0.254: v26.19,26.43 24.05,28.57 v24.05,28.89
N$13
  Top 0.254: U6.44 54.1,18.63 C20.1 54.61,18.26 55.48,19.13 57.17,19.13 L3.2
N$15
  pour Top (no thermals): 35,16.83 35,17.3 36.27,17.3 37.54,18.57 37.54,19.53 39.69,19.53 39.69,18.26 38.58,18.26 37.15,16.83
N$18
  Top 0.254: Q3.5 Q3.6 94.69,36.82 R24.2
N$19
  Top 0.203: U10.2 80.05,14.17 79.69,14.53 79.69,15.08 79.3,15.48 79.3,16.27 78.9,16.67 78.9,18.65 79.61,19.37 80.09,19.37 80.19,19.47 80.36,19.47 U12.1
N$23
  Top 0.203: U10.4 79.94,15.47 79.69,15.72 79.69,16.43 79.3,16.83 79.3,18.49 79.77,18.97 80.57,18.97 80.69,19.09 80.93,19.09 81.24,19.41 U12.2
N$24
  Top 0.254: U6.36 49.1,21.52 C26.1 | C26.1 C23.1 | L4.2 49.05,18.34 49.69,18.97 49.69,20.61 C26.1
N$25  (via drill 0.38)
  Top 0.152: v78.5,19.21 78.74,19.45 78.74,20.72 79.6,21.58 U12.22
  Top 0.203: U15.2 v71.12,21.35
  Bottom 0.152: v78.5,19.21 78.42,19.29 78.42,20.24 78.11,20.56
  Bottom 0.203: v71.12,21.35 71.91,20.56 78.11,20.56
N$28
  Top 0.203: U10.6 79.91,16.77 79.69,16.99 79.69,18.34 79.93,18.57 80.96,18.57 81.74,19.36 U12.3
N$29  (via drill 0.38)
  Top 0.203: v76.04,17.78 75.68,17.42 U10.10 | v81.92,18.57 82.24,18.9 U12.4
  Bottom 0.203: v81.92,18.57 80.88,17.54 76.28,17.54 v76.04,17.78
N$30  (via drill 0.38)
  Top 0.203: U10.12 75.8,16.11 v76.04,15.88 | v82.79,18.18 82.74,18.22 U12.5
  Bottom 0.203: v82.79,18.18 82.55,17.94 82.55,15.8 82.15,15.4 81.52,15.4 80.8,16.11 76.36,16.11 v76.04,15.88
N$31  (via drill 0.38)
  Top 0.203: v83.26,17.07 83.5,17.3 83.5,18.57 83.24,18.83 U12.6 | v76.04,14.21 76,14.17 U10.15
  Bottom 0.203: v83.26,17.07 83.03,16.83 83.03,15.64 82.71,15.32 82.71,14.45 82.23,13.97 81.6,13.97 81.36,14.21 v76.04,14.21
N$32
  Top 0.254: R14.2 33.92,27.46 U5.3 35.56,27.54 36.51,27.54 36.75,27.78 36.75,29.77 36.51,30 U5.1
N$33  (via drill 0.38)
  Top 0.203: U12.20 78.78,22.58 78.29,22.09 U17.8 76.54,22.09 v76.44,21.99 | R27.1 72.87,25.08 v73.34,24.61
  Bottom 0.203: v73.34,24.61 73.66,24.29 73.66,23.57 74.45,22.78 75.64,22.78 v76.44,21.99
N$34
  Top 0.203: U12.19 78.64,23.08 78.18,22.62 76.12,22.62 75.8,22.3 | 75.8,22.3 75.8,21.67 76.12,21.35 76.76,21.35 76.84,21.44 U17.7 | R25.1 73.58,23.65 74.61,22.62 75.49,22.62 75.8,22.3
N$35  (via drill 0.38)
  Top 0.203: v72.79,19.05 R26.1 | U17.6 U17.5 77.66,20.05 v77.79,19.84 | C41.1 69.77,22.88 v69.53,22.86
  Bottom 0.203: v77.79,19.84 73.58,19.84 v72.79,19.05 71.75,19.05 70.17,20.64 70.17,22.23 v69.53,22.86
N$38
  Top 0.203: R15.2 7.94,32.96 7.84,32.96 7.46,33.34 7.46,34.53 7.86,34.92 8.65,34.92 8.81,34.77 8.81,34.1 Q2.5 Q2.6
N$39
  pour Top (no thermals): 19.84,26.99 19.84,25.88 20.24,25.48 20.24,23.5 22.23,21.51 22.23,20.24 24.05,20.24 24.05,22.23 23.42,22.23 21.27,24.37 21.27,25.24 20.8,25.72 20.8,26.99
N$40
  pour Top (no thermals): 17.86,26.91 17.86,26.04 17.07,25.24 17.07,24.21 17.7,23.57 17.7,20.24 19.53,20.24 19.53,22.86 18.34,23.97 18.34,25.4 18.89,25.96 18.89,26.91
N$41
  Top 0.406: U3.17 21.3,25.77 21.51,25.56 21.65,25.56 C6.2
N$42
  Top 0.406: U3.14 19.34,24.84 C13.2
N$43  (via drill 0.38)
  Top 0.203: C4.1 24.77,25.64 25.4,25 26.09,25 R33.2 27.12,24.21 v27.78,24.13 | v15.48,22.86 D4.C
  Top 0.254: U3.18 21.95,27.02 22.3,27.38 23.57,27.38 23.81,27.15 23.81,26.83 24.53,26.11 C4.1 24.71,26.04
  Bottom 0.203: v27.78,24.13 27.46,24.13 25.32,22.07 22.86,22.07 22.07,22.86 v15.48,22.86
N$48  (via drill 0.38)
  Top 0.203: R10.2 22.15,34.11 v22.15,33.73 | v25.4,36.35 25,36.75 25,37.23 24.77,37.47 23.1,37.47 22.41,36.77 C18.2
  Bottom 0.203: v22.15,33.73 24.77,36.35 v25.4,36.35
N$50
  pour Top (no thermals): 26.67,5.64 27.54,5.64 28.65,4.6 28.65,3.49 28.81,3.33 29.45,3.33 29.53,3.41 29.53,5.79 29.21,6.11 28.34,6.11 28.1,6.35 28.1,6.91 27.94,7.06 26.67,7.06
N$51
  pour Top (no thermals): 22.7,3.57 22.7,5.24 22.86,5.4 22.86,6.99 24.13,6.99 24.13,5.71 24.13,3.89 23.81,3.57
NENBL  (via drill 0.38)
  Top 0.203: 84.18,21.08 U12.8 84.5,21.08 v85.01,21.59 | 80.69,29.73 80.88,29.92 80.88,30.08 v81.04,30.24 | v75.33,27.78 75.49,27.62
  Bottom 0.203: v81.04,30.24 80.57,29.77 79.38,29.77 79.06,30.08 78.74,30.08 78.18,29.53 78.18,28.97 76.91,27.7 75.41,27.7 v75.33,27.78 | 80.64,29.84 v81.04,30.24 | v81.04,30.24 81.2,30.08 81.2,29.53 81.36,29.37 81.36,23.42 83.26,21.51 84.93,21.51 v85.01,21.59
NFAULT  (via drill 0.38)
  Top 0.203: 82.94,29.28 v83.82,30.16 84.22,30.56 | v85.33,24.45 86.04,23.73 86.04,21.67 85.25,20.88 84.93,20.88 84.61,20.56 83.99,20.56 U12.7
  Bottom 0.203: v83.82,30.16 83.82,25.4 84.77,24.45 v85.33,24.45
NSLEEP
  Top 0.152: U12.14 82.74,24.25 82.19,24.81
PA27  (via drill 0.38)
  Top 0.203: U6.39 51.59,20.39 v50.96,19.76 | v31.83,17.78 31.75,17.86 U4.3
  Bottom 0.203: v50.96,19.76 50.56,19.37 45.64,19.37 43.74,17.46 39.13,17.46 36.2,14.53 34.21,14.53 33.73,15 33.73,15.88 v31.83,17.78
PB02  (via drill 0.38)
  Top 0.203: 69.53,12.38 U8.8 69.48,12.46 v68.26,12.46 | U6.47 55.6,20.04 55.8,19.84 v56.44,19.84
  Bottom 0.203: v68.26,12.46 68.18,12.38 68.18,11.51 67.79,11.11 67.15,11.11 66.75,11.51 66.75,12.38 59.29,19.84 v56.44,19.84
PB03  (via drill 0.38)
  Top 0.203: U8.9 67.7,11.6 v67.47,11.83 | U6.48 56.29,20.95 v56.59,20.95
  Bottom 0.203: v67.47,11.83 67.47,12.38 59.53,20.32 57.15,20.32 56.59,20.88 v56.59,20.95
PB22  (via drill 0.38)
  Top 0.203: U6.37 50.6,20.51 50.24,20.16 50.24,18.81 49.53,18.1 49.53,16.83 49.93,16.43 50.64,16.43 50.72,16.35 53.26,16.35 54.29,15.32 55.88,15.32 v55.96,15.4 | J2.2 61.14,8.55 60.56,9.13 v60.56,11.59
  Bottom 0.203: v60.56,11.59 59.29,11.59 55.96,14.92 v55.96,15.4
PB23  (via drill 0.38)
  Top 0.203: v36.83,22.38 U5.7 | U6.38 51.08,22.02 50.48,22.62 v50.4,22.62
  Bottom 0.203: v50.4,22.62 49.37,21.59 37.62,21.59 v36.83,22.38
PI_D_N  (via drill 0.38)
  Top 0.203: v21.23,18.02 21.49,18.02 21.49,17.7 21.11,17.7
  Bottom 0.152: 21.49,18.02 arc90 21.17,18.34 15.15,18.34 arc-45 14.79,18.49 9.2,24.08 arc-45 9.05,24.44 9.05,27.19 arc45 8.91,27.55 8.03,28.43 arc45 7.67,28.57 J3.7
  Bottom 0.203: 21.49,18.02 v21.23,18.02
PI_D_P  (via drill 0.38)
  Top 0.203: v22.11,18.02 21.85,18.02 21.85,17.7 22.3,17.7
  Bottom 0.152: 21.85,18.02 21.85,18.14 arc90 21.34,18.65 15.28,18.65 arc-45 14.92,18.8 9.51,24.2 arc-45 9.36,24.56 9.36,27.32 arc45 9.21,27.68 7.11,29.78 arc-45 J3.8
  Bottom 0.203: 21.85,18.02 v22.11,18.02
PI_KILL  (via drill 0.38)
  Top 0.203: v37.94,24.21 37.94,23.97 36.99,23.02 34.45,23.02 34.29,22.86 34.29,22.38 33.81,21.91 33.18,21.91 33.02,22.07 30.72,22.07 30.32,21.67 29.92,22.07 29.21,22.07 28.36,21.22 | v41.91,24.13 42.94,25.16 42.94,27.38 43.66,28.1 45.64,28.1 45.96,27.78 47.86,27.78 48.23,28.14 U6.25
  Bottom 0.203: v37.94,24.21 38.02,24.13 v41.91,24.13
RESET  (via drill 0.38)
  Top 0.203: R1.2 R3.1 C10.1 | U6.40 52.09,19.82 51.09,18.81 v50.96,18.81 | 35.22,12.38 C10.1 | C10.1 35.85,13.02 v36.75,13.02
  Bottom 0.203: JP3.10 1.91,12.78 2.7,13.57 16.03,13.57 17.22,14.76 22.86,14.76 23.34,15.24 23.97,15.24 25.88,17.14 26.51,17.14 27.23,16.43 31.67,16.43 35.08,13.02 v36.75,13.02 40.72,16.99 43.89,16.99 45.8,18.89 50.72,18.89 v50.96,18.81
RX0  (via drill 0.38)
  Top 0.203: v54.53,32.23 54.59,32.17 U6.16
  Bottom 0.203: v54.53,32.23 54.53,31.99 54.13,31.59 15.81,31.59 J1.6
RX1  (via drill 0.38)
  Top 0.203: v46.43,29.29 46.43,30.24 v44.37,32.31 | U6.28 47.92,26.64 47.47,26.19 46.75,26.19 v46.12,26.83
  Bottom 0.203: 40.86,35.66 42.23,34.29 43.81,34.29 44.45,33.66 44.45,32.38 v44.37,32.31 | v46.12,26.83 46.43,27.15 v46.43,29.29
RX2  (via drill 0.38)
  Top 0.203: U6.30 48.28,25.65 47.7,25.08 47.15,25.08 v46.91,24.84 | v11.43,23.42 7.46,19.45 5.24,19.45 3.1,21.59 J3.9
  Bottom 0.203: v11.43,23.42 13.18,25.16 14.13,25.16 16.19,27.23 16.19,27.78 18.41,30 45.24,30 45.64,29.61 45.64,27.54 45.32,27.23 45.32,25.4 45.88,24.84 v46.91,24.84
SCK  (via drill 0.38)
  Top 0.152: U5.16 45.4,29.29 45.72,29.29 45.8,29.21 45.8,28.97 46.2,28.57 47.62,28.57 47.94,28.89 50.09,28.89 50.4,28.57 50.4,28.18 50.96,27.62 51.67,27.62 51.83,27.46 v52.78,27.46
  Top 0.203: J2.5 57.86,6.44 v57.86,7.38 | v52.78,27.46 52.78,28.42 52.58,28.62 U6.20
  Bottom 0.203: v57.86,7.38 57.55,7.7 56.44,7.7 53.02,11.11 53.02,20.48 53.18,20.64 53.18,23.02 52.47,23.73 52.47,27.07 v52.78,27.46
SCL  (via drill 0.38)  (1 unrouted)
  Top 0.203: U13.9 73.1,16.27 v73.58,15.8 | U8.14 70.64,6.19 70.48,6.03 69.06,6.03 63.98,11.11 v63.98,10.95 | U11.2 50.63,10.64 51.04,10.24 51.04,8.97 51.28,8.73 52.55,8.73 v53.1,9.29 53.66,9.29 54.69,10.32 54.69,11.03 v54.77,11.11 | v43.26,11.67 43.04,11.88 | v54.45,25.88 54.45,24.92 v53.66,24.13 52.47,25.32 50.72,25.32 50.04,24.64 U6.32 | U17.3 75.1,20.79 76.6,19.29 76.83,19.29 78.11,18.02 78.11,16.35 78.5,15.95 78.5,14.37 76.76,12.62 72.87,12.62 72.07,13.41 68.42,13.41 v68.1,13.73 | U4.8 v26.11,15.32 | U16.P$2 62.51,28.86 v62.71,29.05 62.79,29.05 63.5,28.34 63.5,26.26 R28.3
  Bottom 0.203: v73.58,15.8 71.99,15.8 71.44,15.24 70.72,15.24 69.85,14.37 69.85,13.81 69.22,13.18 | v53.1,9.29 52.7,8.89 48.82,8.89 46.04,11.67 v43.26,11.67 43.26,11.83 41.99,13.1 39.53,13.1 38.18,11.75 35.08,11.75 31.35,15.48 26.27,15.48 v26.11,15.32 | 69.22,13.18 69.22,10.64 63.98,10.64 | 63.98,10.64 56.52,10.64 56.04,11.11 v54.77,11.11 53.82,12.06 53.82,20.16 53.98,20.32 53.98,23.81 v53.66,24.13 53.82,23.97 | 69.22,13.18 68.66,13.18 v68.1,13.73 | v54.45,25.88 54.77,25.88 55.72,26.75 59.49,26.75 U16.P$2 62.51,28.86 v62.71,29.05 | v63.98,10.95 63.98,10.64
SCL_BUFF  (via drill 0.38)
  Top 0.203: R28.2 64.38,27.47 65.77,28.86 U16.P$7 66.47,28.97 v68.02,28.97
  Bottom 0.203: J4.12 97.47,24.77 99.46,26.75 99.46,30.4 94.85,35 90.81,35 88.74,37.07 84.45,37.07 81.68,34.29 72.95,34.29 72.39,33.73 72.39,30.16 71.2,28.97 v68.02,28.97
SDA  (via drill 0.38)  (1 unrouted)
  Top 0.203: U13.11 72.15,14.84 v72.63,14.84 73.82,13.65 73.82,13.26 74.06,13.02 76.6,13.02 78.11,14.53 78.11,15.8 77.71,16.19 77.71,17.86 76.68,18.89 76.44,18.89 75.19,20.14 U17.4 | U8.13 68.52,8.4 v68.5,8.41 | v55.4,11.99 v55.4,10.4 53.34,8.33 51.04,8.33 50.64,8.73 49.29,8.73 48.74,9.29 48.74,9.92 49.21,10.4 49.37,10.4 49.98,11.01 U11.1 49.39,11.15 48.74,11.8 v48.74,12.78 | U4.7 26.04,16.59 v26.19,16.43 | v53.66,25.16 53.34,25.16 52.78,25.72 50.48,25.72 49.91,25.15 U6.31 | U16.P$3 62.67,28.13 v62.71,28.1 63.02,27.78 63.02,26.59 62.78,26.34 R28.4
  Bottom 0.203: v72.63,14.84 70.88,14.84 70.25,14.21 70.25,13.57 69.69,13.02 69.69,10.16 | v68.5,8.41 69.69,9.6 69.69,10.16 | v55.4,10.4 56.12,10.4 56.36,10.16 69.69,10.16 | v55.4,11.99 54.21,13.18 54.21,20 54.37,20.16 54.37,24.45 v53.66,25.16 54.69,25.16 55.88,26.27 59.69,26.27 61.52,28.1 v62.71,28.1 | v26.19,16.43 26.67,15.95 31.51,15.95 35.24,12.22 37.94,12.22 39.29,13.57 47.86,13.57 48.66,12.78 v48.74,12.78
SDA_BUFF  (via drill 0.38)
  Top 0.203: v88.42,36.43 87.79,37.07 78.34,37.07 77.47,36.2 77.47,35 76.76,34.29 72.95,34.29 72.39,33.73 72.39,32.07 71.52,31.19 71.28,31.19 68.18,28.1 66.39,28.1 U16.P$6 65.68,28.13 65.18,27.63 R28.1
  Bottom 0.203: J4.13 99.06,27.84 99.06,30.24 94.69,34.61 90.25,34.61 v88.42,36.43
STEPFREQ  (via drill 0.38)
  Top 0.203: 56.08,25.67 v56.2,25.56 55.56,26.19 55.56,28.18 56.08,28.7 U6.13
  Bottom 0.203: v72.95,27.78 71.2,27.78 70.09,26.67 63.5,26.67 61.83,25 57.15,25 56.59,25.56 v56.2,25.56
SWDCLK  (via drill 0.38)
  Top 0.203: U6.45 54.59,20.03 v54.93,19.68 | v56.83,11.35 56.12,10.64 56.12,10 55.72,9.6 55.24,9.6 52.23,6.59 52.23,4.45 48.9,1.11 37.47,1.11 34.85,3.73 v34.77,3.73
  Bottom 0.203: v54.93,19.68 54.61,19.37 54.61,13.97 56.83,11.75 v56.83,11.35 | v34.77,3.73 35.08,3.41 35.48,3.41 35.72,3.17 37.47,3.17 37.94,3.65 37.94,5 32.46,10.48 31.83,10.48 31.43,10.08 31.43,9.21 30,7.78 13.65,7.78 12.62,8.81 R30.1 12.56,9.29 11.59,9.29 9.45,11.43 8.26,11.43 3.49,6.67 1.51,6.67 1.03,7.14 1.03,8.02 JP3.4
SWDIO  (via drill 0.38)
  Top 0.203: U6.46 55.09,22.31 v55.17,22.38 | v57.78,11.35 57.78,11.27 56.59,10.08 56.59,9.84 55.88,9.13 55.4,9.13 52.7,6.43 52.7,4.29 49.05,0.64 37.23,0.64 35.16,2.7 v34.85,2.7 | v14.29,8.57 12.78,7.06 3.89,7.06 3.49,6.67 2.86,6.67 JP3.2
  Bottom 0.203: v55.17,22.38 55.17,20.4 55.56,20 55.56,19.29 55.01,18.73 55.01,14.29 57.78,11.51 v57.78,11.35 | v34.85,2.7 37.62,2.7 38.42,3.49 38.42,5.16 32.62,10.95 31.67,10.95 30.96,10.24 30.96,9.37 29.84,8.26 14.61,8.26 v14.29,8.57
SYNC  (via drill 0.38)
  Top 0.203: U6.24 50.6,31 49.53,32.07 v49.53,34.29 | v59.69,31.83 59.69,33.81 59.21,34.29 v54.61,34.29 | v71.68,30.48 72.79,31.59 77.21,31.59
  Bottom 0.203: v59.69,31.83 59.85,31.67 70.48,31.67 v71.68,30.48 | v49.53,34.29 v54.61,34.29
TX0  (via drill 0.38)
  Top 0.203: v57.23,32.23 56.59,31.59 55.48,31.59 55.09,31.2 U6.15
  Bottom 0.203: v57.23,32.23 57.23,31.99 56.44,31.19 16.91,31.19 15.16,29.45 13.74,29.45 J1.7
TX1  (via drill 0.38)
  Top 0.203: v47.39,29.29 47.07,29.61 v47.07,32.31 | U6.27 47.39,27.15 v47.15,26.91
  Bottom 0.203: 43.52,35.46 44.69,34.29 46.43,34.29 46.99,33.73 46.99,32.38 v47.07,32.31 | v47.39,29.29 47.39,28.02 47.15,27.78 v47.15,26.91
TX2  (via drill 0.38)
  Top 0.203: U6.29 48.07,26.16 47.55,25.64 v46.12,25.64 | v10.72,24.05 6.59,19.92 5.4,19.92 4.28,21.04 J3.10
  Bottom 0.203: v10.72,24.05 12.3,25.64 13.97,25.64 15.8,27.46 15.8,27.94 18.26,30.4 47.47,30.4 48.1,29.77 48.1,28.81 47.86,28.57 47.86,26.59 46.91,25.64 v46.12,25.64
USB_D_N  (via drill 0.38)
  Top 0.152: 15.64,25.02 arc-45 15.58,25 7.52,25 arc45 7.16,24.85 J3.4
  Top 0.203: 15.64,25.02 v15.64,25.29 | v47.78,24.34 47.78,24.07 48.1,24.07 arc-45 48.31,24.16 U6.33
  Bottom 0.152: 47.78,24.07 45.97,24.07 arc-45 45.61,24.22 44.98,24.85 arc45 44.62,25 42.82,25 arc-45 42.46,25.15 41.8,25.8 arc45 41.45,25.95 27.29,25.95 arc45 26.93,25.8 24.61,23.48 arc-45 24.25,23.33 23.77,23.33 arc-45 23.41,23.48 22.02,24.87 arc45 21.66,25.02 15.64,25.02
  Bottom 0.203: 15.64,25.02 v15.64,25.29 | 47.78,24.07 v47.78,24.34
USB_D_P  (via drill 0.38)
  Top 0.152: 15.64,24.67 arc45 15.58,24.69 8.63,24.69 arc45 8.27,24.54 7.37,23.64 arc-45 7.01,23.5 J3.3
  Top 0.203: 15.64,24.67 v15.64,24.4 | v47.78,23.45 47.78,23.71 48.1,23.71 arc45 48.26,23.65 U6.34
  Bottom 0.152: 47.78,23.71 45.89,23.71 arc-45 45.53,23.86 44.85,24.54 arc45 44.49,24.69 42.69,24.69 arc-45 42.33,24.84 41.68,25.5 arc45 41.32,25.64 27.42,25.64 arc45 27.06,25.5 24.74,23.17 arc-45 24.38,23.02 23.64,23.02 arc-45 23.28,23.17 21.94,24.52 arc45 21.58,24.67 15.64,24.67
  Bottom 0.203: 15.64,24.67 v15.64,24.4 | 47.78,23.71 v47.78,23.45
V_SENSE  (via drill 0.38)
  Top 0.203: U6.3 61.28,23.65 61.91,23.02 v61.91,22.86 | R17.1 65.7,19.57 R16.2 65.33,20 66.2,20.88 66.2,21.11 66.83,21.75 66.83,22.3 66.28,22.86 v66.28,23.42
  Bottom 0.203: v61.91,22.86 62.15,22.62 64.69,22.62 65.25,23.18 66.04,23.18 v66.28,23.42
VCC  (via drill 0.38)
  Top 0.406: J1.1 9.95,31.11 C42.1
  other vias: 19.13,34.29 19.13,33.5 19.53,32.86
  pour Top (no thermals): 19.13,31.51 20.8,31.51 20.8,32.31 21.51,33.02 21.51,34.61 18.81,34.61 18.81,33.02 19.13,32.7
  pour Bottom (no thermals): 19.53,34.61 13.26,34.61 10,31.35 10,30.8 11.67,29.13 12.14,29.13 12.7,29.69 12.7,31.99 13.89,33.18 18.81,33.18 19.45,32.54 19.68,32.54 19.92,32.78 19.92,34.21
VREFA
  Top 0.152: U6.4 56.78,24.16 56.59,23.97 56.59,22.38 56.75,22.23 57.52,22.23 L6.1
  Top 0.203: C35.1 60.25,18.99 60.25,19.29 60.09,19.45 59.21,19.45 58.98,19.68 58.98,20.77 L6.1
XIN32
  Top 0.203: C7.1 62.01,20.24 XTAL1.P2 60.25,21.59 59.93,21.91 59.21,21.91 58.98,22.15 58.98,22.46 58.78,22.66 U6.1
XOUT32
  Top 0.203: U6.2 59.89,23.14 XTAL1.P1 60.9,22.79 C8.1

## Text on the board
tPlace: SWD
bPlace: UMD Nearspace / MDSGC | 5-2017 Rev. 2
ASM_Res: 4.7k | 10k | 3.6k | 4.7k | 4.7k | 10k | 4.7k | 6.8k | 4.7k | 100k | 10k | 845k | 33k | 158k | 100k | 191k | 100k | 191k | 191k | 10k | 1.05 | 1.05 | 33k | 100k | 191k | 6.2 | 10k | 4.7k | 4.7k | 4.7k | 330 | 270k
ASM_IC: P82B75 | FDG8842 | MIC5319 | MT25QL | SAMD21 | FDG8842 | FDG8842 | FDG8842 | LTC3112 | TCA9535 | DS3231 | MC14504 | ADXL375 | MAX31275 | BMX055 | LT8301 | LT3465 | PCA9306
ASM_Cap: 6.8pF | 100nF | 6.8pF | 100nF | 1uF | 100nF | 1uF | 47uF | 10uF | 47pF | 1uF | 4.7uF | 680pF | 22pF | 1uF | 100nF | 2.2uF | 100nF | 100nF | 10uF | 100nF | 1uF | 4.7uF | 10uF | 100nF | 100nF | 1nF | 1uF | 10uF | 100nF | 100nF | 100nF | 10uF | 100nF | 100nF | 10uF | 100nF | 100nF
ASM_Misc: 10uH | 10uH | 10uH | 32kHz | 10uH | 4.7uH | STPS1150 | CMDZ5257B | CMHD4448 | 22uH | Ferrite Bead